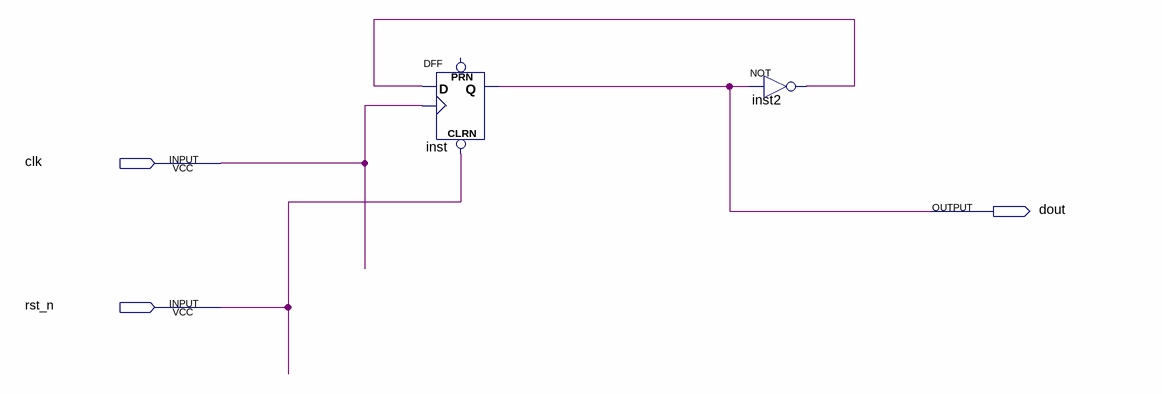
[diagram p0: schematic sheet]
// Quartus schematic counter2.bdf as structural Verilog: 2 symbols, 3 pins
module counter2 (
  input  clk,
  input  rst_n,
  output dout
);

  wire inst2_out;

  DFF inst (.CLRN(rst_n), .CLK(clk), .D(inst2_out), .Q(dout));  // open: PRN
  not inst2 (inst2_out, dout);
endmodule
